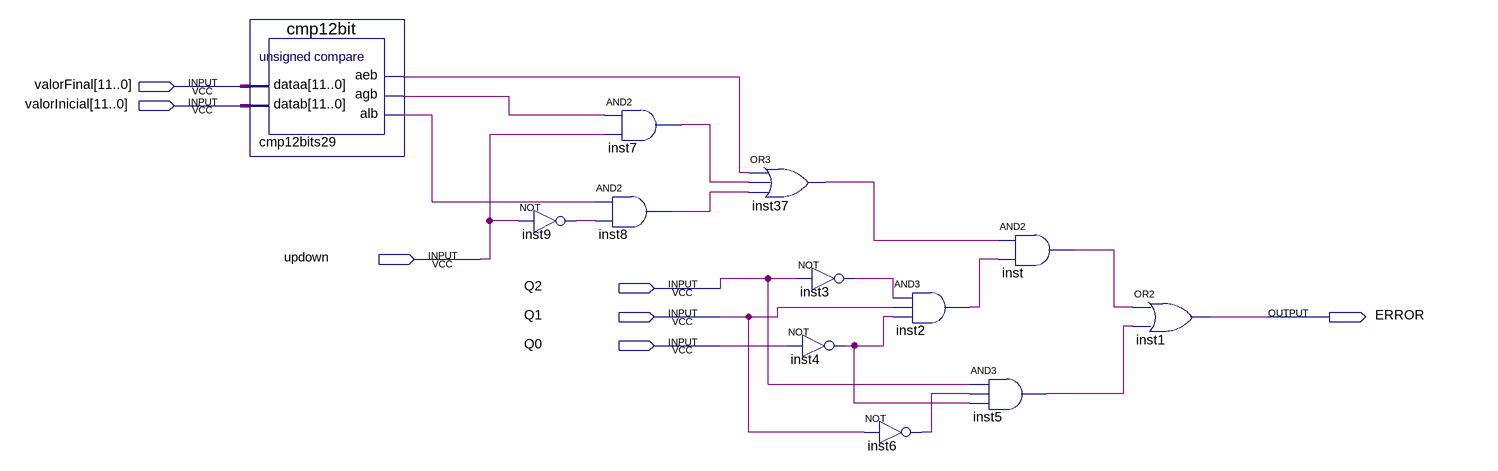
[diagram p0: schematic sheet]
// Quartus schematic probandoERROR.bdf as structural Verilog: 12 symbols, 7 pins
module probandoERROR (
  input  [11:0] valorFinal,
  input  [11:0] valorInicial,
  input  updown,
  input  Q2,
  input  Q1,
  input  Q0,
  output ERROR
);

  wire cmp12bits29_aeb, cmp12bits29_agb, cmp12bits29_alb, inst2_out, inst3_out, inst4_out, inst5_out,
       inst6_out, inst7_out, inst8_out, inst9_out, inst37_out, inst_out;

  cmp12bit cmp12bits29 (
    .dataa(valorFinal), .datab(valorInicial), .aeb(cmp12bits29_aeb), .agb(cmp12bits29_agb),
    .alb(cmp12bits29_alb));
  not inst9 (inst9_out, updown);
  and inst7 (inst7_out, cmp12bits29_agb, updown);
  and inst8 (inst8_out, cmp12bits29_alb, inst9_out);
  or inst37 (inst37_out, cmp12bits29_aeb, inst7_out, inst8_out);
  not inst3 (inst3_out, Q2);
  not inst4 (inst4_out, Q0);
  and inst2 (inst2_out, inst3_out, Q1, inst4_out);
  not inst6 (inst6_out, Q1);
  and inst (inst_out, inst37_out, inst2_out);
  and inst5 (inst5_out, Q2, inst6_out, inst4_out);
  or inst1 (ERROR, inst_out, inst5_out);
endmodule
